# EAGLE schematic TLC5940Driver (EAGLE 7.2.0)
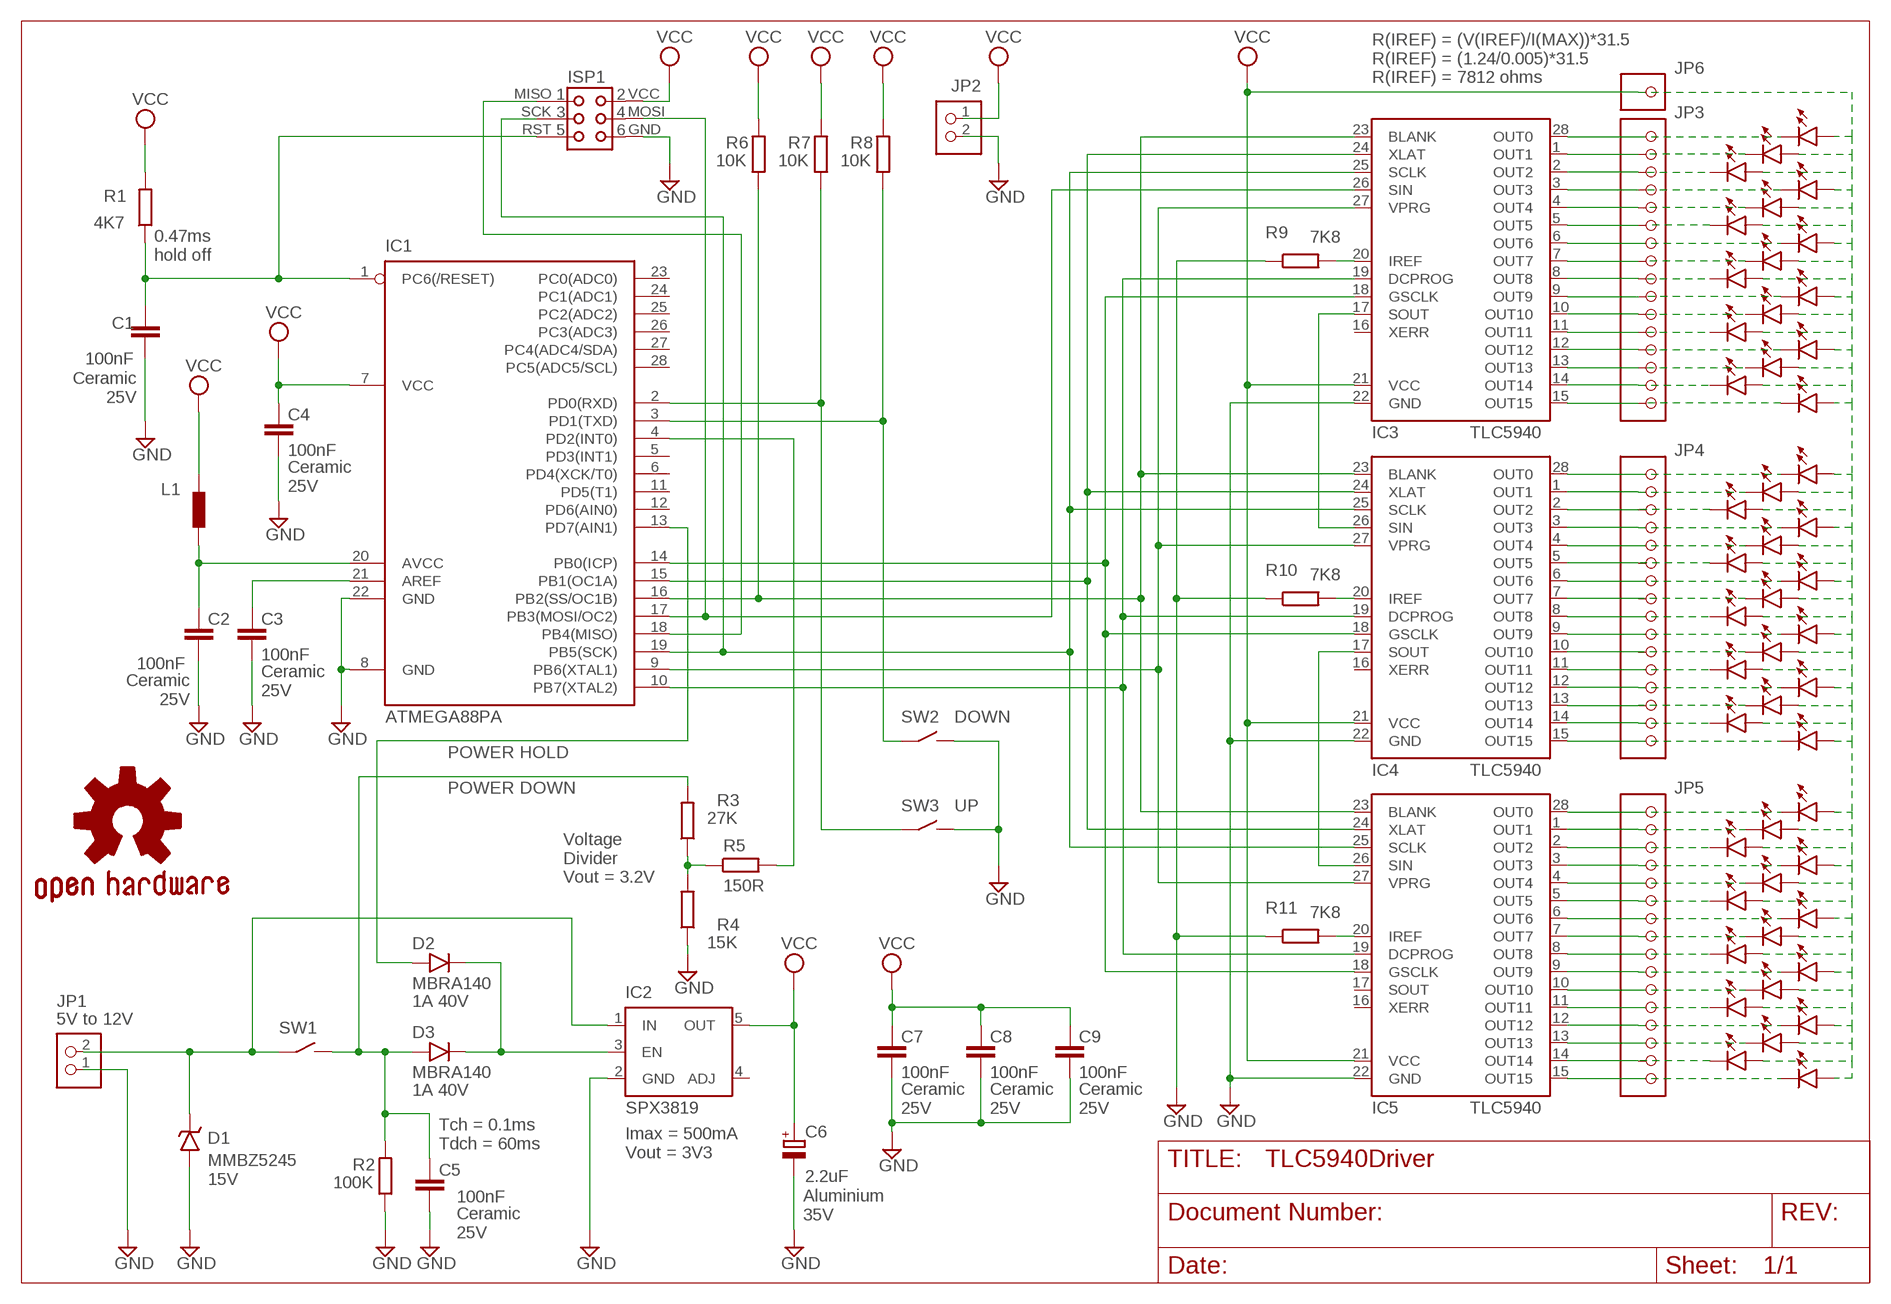
[diagram p0: schematic, sheet 1]

## Parts
C1  100nF  CAPACITOR  [P-0805]
C2  100nF  CAPACITOR  [P-0805]
C3  100nF  CAPACITOR  [P-0805]
C4  100nF  CAPACITOR  [P-0805]
C5  100nF  CAPACITOR  [P-0805]
C6  2.2uF  CAPACITOR-POL3  [P-CAPNICHICON-3MM]
C7  100nF  CAPACITOR  [P-0805]
C8  100nF  CAPACITOR  [P-0805]
C9  100nF  CAPACITOR  [P-0805]
D1  ZENERS1  [P-SOT23-3]
D2  MBRA140  DIODE  [P-SMA]
D3  MBRA140  DIODE  [P-SMA]
GOLD_ORB_SM1  OSHWLOGO_GOLD_ORB_SM  [OSHW2]
IC1  ATMEGA88PA  ATMEGA8/28PIN  [P-DIL28]
IC2  SPX3819  VOLTAGE-REGULATOR-5PINEXTENDEDPADS  [P-SOT23-5E]
IC3  TLC5940  TLC59401  [P-DIL28]
IC4  TLC5940  TLC59401  [P-DIL28]
IC5  TLC5940  TLC59401  [P-DIL28]
ISP1  AVR-ISP-HEADERSHROUDED  [P-AVRISPSHROUDED]
JP1  JST-XH-1X021  [P-JST-XH-1X02]
JP2  JST-XH-1X021  [P-JST-XH-1X02]
JP3  HEADER-1X16  [P-1X16]
JP4  HEADER-1X16  [P-1X16]
JP5  HEADER-1X16  [P-1X16]
JP6  HEADER-1X01  [P-1X01]
L1  INDUCTOR1  [P-0805]
LED1  LED1  [P-PLCC2]
LED2  LED1  [P-PLCC2]
LED3  LED1  [P-PLCC2]
LED4  LED1  [P-PLCC2]
LED5  LED1  [P-PLCC2]
LED6  LED1  [P-PLCC2]
LED7  LED1  [P-PLCC2]
LED8  LED1  [P-PLCC2]
LED9  LED1  [P-PLCC2]
LED10  LED1  [P-PLCC2]
LED11  LED1  [P-PLCC2]
LED12  LED1  [P-PLCC2]
LED13  LED1  [P-PLCC2]
LED14  LED1  [P-PLCC2]
LED15  LED1  [P-PLCC2]
LED16  LED1  [P-PLCC2]
LED17  LED1  [P-PLCC2]
LED18  LED1  [P-PLCC2]
LED19  LED1  [P-PLCC2]
LED20  LED1  [P-PLCC2]
LED21  LED1  [P-PLCC2]
LED22  LED1  [P-PLCC2]
LED23  LED1  [P-PLCC2]
LED24  LED1  [P-PLCC2]
LED25  LED1  [P-PLCC2]
LED26  LED1  [P-PLCC2]
LED27  LED1  [P-PLCC2]
LED28  LED1  [P-PLCC2]
LED29  LED1  [P-PLCC2]
LED30  LED1  [P-PLCC2]
LED31  LED1  [P-PLCC2]
LED32  LED1  [P-PLCC2]
LED33  LED1  [P-PLCC2]
LED34  LED1  [P-PLCC2]
LED35  LED1  [P-PLCC2]
LED36  LED1  [P-PLCC2]
LED37  LED1  [P-PLCC2]
LED38  LED1  [P-PLCC2]
LED39  LED1  [P-PLCC2]
LED40  LED1  [P-PLCC2]
LED41  LED1  [P-PLCC2]
LED42  LED1  [P-PLCC2]
LED43  LED1  [P-PLCC2]
LED44  LED1  [P-PLCC2]
LED45  LED1  [P-PLCC2]
LED46  LED1  [P-PLCC2]
LED47  LED1  [P-PLCC2]
LED48  LED1  [P-PLCC2]
R1  4K7  RESISTOR""  [P-0805]
R2  100K  RESISTOR""  [P-0805]
R3  27K  RESISTOR""  [P-0805]
R4  15K  RESISTOR""  [P-0805]
R5  150R  RESISTOR""  [P-0805]
R6  10K  RESISTOR""  [P-0805]
R7  10K  RESISTOR""  [P-0805]
R8  10K  RESISTOR""  [P-0805]
R9  7K8  RESISTOR""  [P-0805]
R10  7K8  RESISTOR""  [P-0805]
R11  7K8  RESISTOR""  [P-0805]
SW1  SWITCH-2PIN4  [P-JST-XH-1X02-VERT]
SW2  SWITCH-2PIN4  [P-JST-XH-1X02-VERT]
SW3  SWITCH-2PIN4  [P-JST-XH-1X02-VERT]

## Nets
GND: C1.2 C2.2 C3.2 C4.2 C5.2 C6.2(-) C7.2 C8.2 C9.2 D1.1(A) IC1.8(GND) IC1.22(GND) IC2.2(GND) IC3.22(GND) IC4.22(GND) IC5.22(GND) ISP1.GND JP1.1 JP2.2 R2.1 R4.1 R9.1 R10.1 R11.1 SW2.2 SW3.2
N$1: D1.3(C) IC2.1(IN) JP1.2 SW1.1
N$2: C5.1 D3.A R2.2 R3.2 SW1.2
N$3: IC3.28(OUT0) JP3.1 LED1.C
N$4: D2.K(C) D3.K(C) IC2.3(EN)
N$5: IC3.1(OUT1) JP3.2
N$6: IC3.2(OUT2) JP3.3
N$7: IC3.3(OUT3) JP3.4
N$8: IC3.4(OUT4) JP3.5
N$9: IC3.5(OUT5) JP3.6
N$10: IC3.6(OUT6) JP3.7 LED7.C
N$11: IC3.7(OUT7) JP3.8
N$12: IC3.8(OUT8) JP3.9
N$13: IC3.9(OUT9) JP3.10
N$14: IC3.10(OUT10) JP3.11
N$15: IC3.11(OUT11) JP3.12
N$16: IC3.12(OUT12) JP3.13
N$17: IC3.13(OUT13) JP3.14
N$18: IC3.14(OUT14) JP3.15 LED15.C
N$19: IC3.15(OUT15) JP3.16
N$20: IC4.28(OUT0) JP4.1 LED17.C
N$21: IC4.1(OUT1) JP4.2 LED18.C
N$22: IC4.2(OUT2) JP4.3 LED19.C
N$23: IC4.3(OUT3) JP4.4 LED20.C
N$24: IC4.4(OUT4) JP4.5 LED21.C
N$25: IC4.5(OUT5) JP4.6 LED22.C
N$26: IC4.6(OUT6) JP4.7 LED23.C
N$27: IC4.7(OUT7) JP4.8 LED24.C
N$28: IC4.8(OUT8) JP4.9 LED25.C
N$29: IC4.9(OUT9) JP4.10 LED26.C
N$30: IC4.10(OUT10) JP4.11 LED27.C
N$31: IC4.11(OUT11) JP4.12 LED28.C
N$32: IC4.12(OUT12) JP4.13 LED29.C
N$33: IC4.13(OUT13) JP4.14 LED30.C
N$34: IC4.14(OUT14) JP4.15 LED31.C
N$35: IC4.15(OUT15) JP4.16 LED32.C
N$36: IC5.28(OUT0) JP5.1 LED33.C
N$37: IC5.1(OUT1) JP5.2 LED34.C
N$38: IC5.2(OUT2) JP5.3 LED35.C
N$39: IC5.3(OUT3) JP5.4 LED36.C
N$40: IC5.4(OUT4) JP5.5 LED37.C
N$41: IC5.5(OUT5) JP5.6 LED38.C
N$42: IC5.6(OUT6) JP5.7 LED39.C
N$43: IC5.7(OUT7) JP5.8 LED40.C
N$44: IC5.8(OUT8) JP5.9 LED41.C
N$45: IC5.9(OUT9) JP5.10 LED42.C
N$46: IC5.10(OUT10) JP5.11 LED43.C
N$47: IC5.11(OUT11) JP5.12 LED44.C
N$48: IC5.12(OUT12) JP5.13 LED45.C
N$49: IC5.13(OUT13) JP5.14 LED46.C
N$50: IC5.14(OUT14) JP5.15 LED47.C
N$51: IC5.15(OUT15) JP5.16 LED48.C
N$52: IC1.16(PB2(SS/OC1B)) IC3.23(BLANK) IC4.23(BLANK) IC5.23(BLANK) R6.1
N$53: D2.A IC1.13(PD7(AIN1))
N$54: IC1.2(PD0(RXD)) R7.1 SW3.1
N$55: C1.1 IC1.1(PC6(/RESET)) ISP1.RST R1.1
N$56: C2.1 IC1.20(AVCC) L1.1
N$57: C3.1 IC1.21(AREF)
N$58: IC1.19(PB5(SCK)) IC3.25(SCLK) IC4.25(SCLK) IC5.25(SCLK) ISP1.SCK
N$59: IC1.18(PB4(MISO)) ISP1.MISO
N$60: IC1.17(PB3(MOSI/OC2)) IC3.26(SIN) ISP1.MOSI
N$61: LED16.C
N$62: IC1.4(PD2(INT0)) R5.2
N$63: IC1.3(PD1(TXD)) R8.1 SW2.1
N$64: IC5.20(IREF) R11.2
N$65: IC3.17(SOUT) IC4.26(SIN)
N$66: IC4.17(SOUT) IC5.26(SIN)
N$67: IC1.15(PB1(OC1A)) IC3.24(XLAT) IC4.24(XLAT) IC5.24(XLAT)
N$68: IC1.14(PB0(ICP)) IC3.18(GSCLK) IC4.18(GSCLK) IC5.18(GSCLK)
N$69: IC1.10(PB7(XTAL2)) IC3.19(DCPROG) IC4.19(DCPROG) IC5.19(DCPROG)
N$70: IC1.9(PB6(XTAL1)) IC3.27(VPRG) IC4.27(VPRG) IC5.27(VPRG)
N$71: LED14.C
N$72: IC4.20(IREF) R10.2
N$73: R3.1 R4.2 R5.1
N$74: IC3.20(IREF) R9.2
N$75: LED13.C
N$76: LED12.C
N$77: LED11.C
N$78: LED10.C
N$79: LED9.C
N$80: LED8.C
N$81: LED2.C
N$82: LED3.C
N$83: LED6.C
N$84: LED5.C
N$85: LED4.C
VCC: C4.1 C6.1(+) C7.1 C8.1 C9.1 IC1.7(VCC) IC2.5(OUT) IC3.21(VCC) IC4.21(VCC) IC5.21(VCC) ISP1.VCC JP2.1 JP6.1 L1.2 LED1.A LED2.A LED3.A LED4.A LED5.A LED6.A LED7.A LED8.A LED9.A LED10.A LED11.A LED12.A LED13.A LED14.A LED15.A LED16.A LED17.A LED18.A LED19.A LED20.A LED21.A LED22.A LED23.A LED24.A LED25.A LED26.A LED27.A LED28.A LED29.A LED30.A LED31.A LED32.A LED33.A LED34.A LED35.A LED36.A LED37.A LED38.A LED39.A LED40.A LED41.A LED42.A LED43.A LED44.A LED45.A LED46.A LED47.A LED48.A R1.2 R6.2 R7.2 R8.2
Unconnected: IC1.5(PD3(INT1)) IC1.6(PD4(XCK/T0)) IC1.11(PD5(T1)) IC1.12(PD6(AIN0)) IC1.23(PC0(ADC0)) IC1.24(PC1(ADC1)) IC1.25(PC2(ADC2)) IC1.26(PC3(ADC3)) IC1.27(PC4(ADC4/SDA)) IC1.28(PC5(ADC5/SCL)) IC2.4(ADJ) IC3.16(XERR) IC4.16(XERR) IC5.16(XERR) IC5.17(SOUT)

## Notes on the sheet
- R(IREF) = (V(IREF)/I(MAX))*31.5
  R(IREF) = (1.24/0.005)*31.5
  R(IREF) = 7812 ohms
- 0.47ms
  hold off
- Ceramic
  25V
- Ceramic
  25V
- Ceramic
  25V
- Ceramic
  25V
- DOWN
- POWER HOLD
- POWER DOWN
- UP
- Voltage
  Divider
  Vout = 3.2V
- 1A 40V
- 5V to 12V
- 1A 40V
- Ceramic
  25V
- Ceramic
  25V
- Ceramic
  25V
- Tch = 0.1ms
  Tdch = 60ms
- Imax = 500mA
  Vout = 3V3
- MMBZ5245
  15V
- Aluminium
  35V
- Ceramic
  25V

## Library data of the parts
C1-C5 C7-C9 = dn-electronics:CAPACITOR: Capacitors
C6 = dn-electronics:CAPACITOR-POL: Capacitors with Polarity
D1 = dn-electronics:ZENERS: Zener Diodes
D2 D3 = dn-electronics:DIODE: Diodes
GOLD_ORB_SM1 = bfl:OSHWLOGO: These are Open-Source Hardware logos.
IC1 = dn-electronics:ATMEGA8/28PIN: ATMEGA48/88/168/328 28 pins
IC2 = dn-electronics:VOLTAGE-REGULATOR-5PIN: Voltage Regulators 5 Pin
IC3-IC5 = dn-electronics:TLC5940: TLC5940
ISP1 = dn-electronics:AVR-ISP-HEADER: AVR ISP Header Shrouded 2x03: RS - 7407105
JP1 JP2 = dn-electronics:JST-XH-1X02: JST XH 1x02
JP3-JP5 = dn-electronics:HEADER-1X16: Header 1x16
JP6 = dn-electronics:HEADER-1X01: Header 1x01
L1 = dn-electronics:INDUCTOR: Inductor
LED1-LED48 = dn-electronics:LED: LED 1) PLCC2 2) C8WT803
R1-R11 = dn-electronics:RESISTOR: Resistors
SW1-SW3 = dn-electronics:SWITCH-2PIN: Switches 2 Pin SMT Tactile DTSM31NV: RS - 3786325